# Altium schematic sheet Altium_SCH_ThinkClamp_v0.6.1_tpreset.SchDoc: ThinkClamp v0.6.1
size A4; Date: 18/04/2014
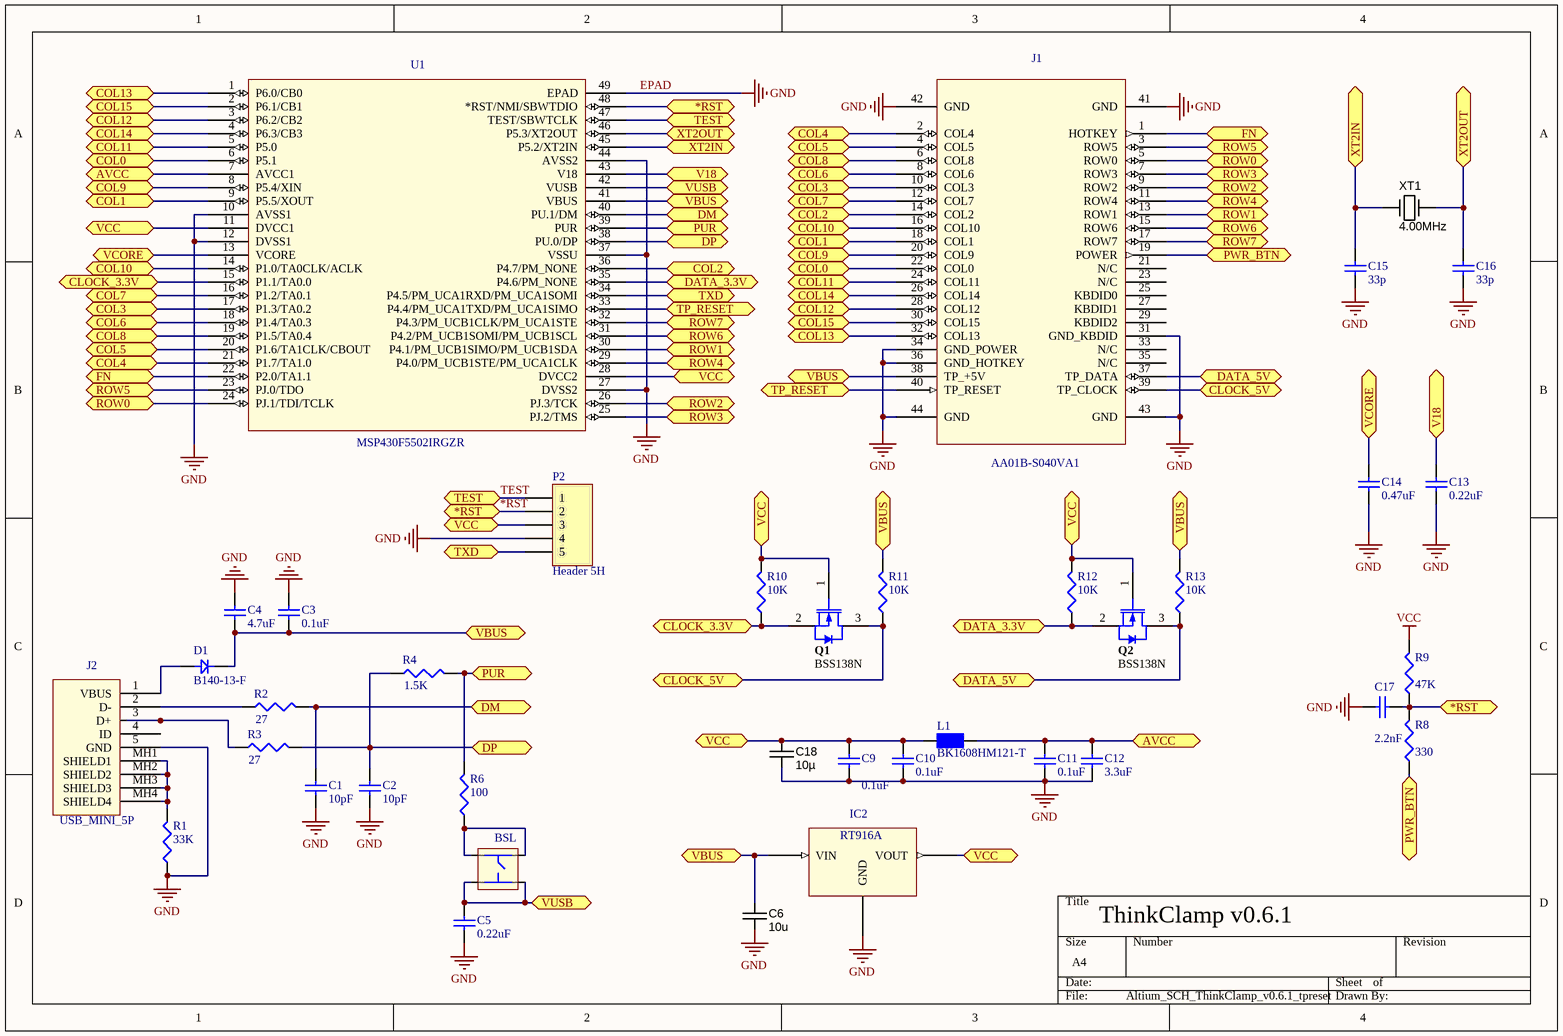
[diagram p0: Altium_SCH_ThinkClamp_v0.6.1_tpreset.SchDoc]

## Parts
BSL  TL3301  [TL3301]  (value not drawn)
C1  value 10pF  [1608[0603]]  (hidden comment: Cap Semi)
C2  value 10pF  [1608[0603]]  (hidden comment: Cap Semi)
C3  value 0.1uF  [1608[0603]]  (hidden comment: Cap Semi)
C4  value 4.7uF  [1608[0603]]  (hidden comment: Cap Semi)
C5  value 0.22uF  [1608[0603]]  (hidden comment: Cap Semi)
C6  value 10u  [CAPC3216X180N]  (hidden comment: approved sub OK)
C9  value 0.1uF  [1608[0603]]  (hidden comment: Cap Semi)
C10  value 0.1uF  [1608[0603]]  (hidden comment: Cap Semi)
C11  value 0.1uF  [1608[0603]]  (hidden comment: Cap Semi)
C12  value 3.3uF  [1608[0603]]  (hidden comment: Cap Semi)
C13  value 0.22uF  [1608[0603]]  (hidden comment: Cap Semi)
C14  value 0.47uF  [1608[0603]]  (hidden comment: Cap Semi)
C15  value 33p  [1608[0603]]  (hidden comment: Cap Semi)
C16  value 33p  [1608[0603]]  (hidden comment: Cap Semi)
C17  value 2.2nF  [1608[0603]]  (hidden comment: Cap Semi)
C18  value 10µ  [CAPC3216X180N]  (hidden comment: approved sub OK)
D1  B140-13-F  [SMA]
IC2  RT9164A LDO  [SOT223]  (value not drawn)
J1  AA01B-S040VA1  [AA01B-S040VA1]
J2  USB_MINI_5P  [USB_Mini-B_Molex_SMT]
L1  BK1608HM121-T  [BK1608HM121-T]
P2  Header 5H  [HDR1X5H]
Q1  BSS138N  [INF-PG-SOT23_N]
Q2  BSS138N  [INF-PG-SOT23_N]
R1  value 33K  [J1-0603]  (hidden comment: Res3)
R2  value 27  [J1-0603]  (hidden comment: Res3)
R3  value 27  [J1-0603]  (hidden comment: Res3)
R4  value 1.5K  [J1-0603]  (hidden comment: Res3)
R6  value 100  [J1-0603]  (hidden comment: Res3)
R8  value 330  [J1-0603]  (hidden comment: Res3)
R9  value 47K  [J1-0603]  (hidden comment: Res3)
R10  value 10K  [J1-0603]  (hidden comment: Res3)
R11  value 10K  [J1-0603]  (hidden comment: Res3)
R12  value 10K  [J1-0603]  (hidden comment: Res3)
R13  value 10K  [J1-0603]  (hidden comment: Res3)
U1  MSP430F5502IRGZR  [RGZ48_5P15X5P15]
XT1  4.00MHz  [CRYSTAL_HC49-US-SM]

## Ports
*RST, AVCC, CLOCK_3.3V, CLOCK_5V, COL0, COL1, COL2, COL3, COL4, COL5, COL6, COL7, COL8, COL9, COL10, COL11, COL12, COL13, COL14, COL15, DATA_3.3V, DATA_5V, DM, DP, FN, PUR, PWR_BTN, ROW0, ROW1, ROW2, ROW3, ROW4, ROW5, ROW6, ROW7, TEST, TP_RESET, TXD, V18, VBUS, VCC, VCORE, VUSB, XT2IN, XT2OUT

## Nets
EPAD: C1.1 C2.1 C3.2 C4.2 C5.1 C6.2 C9.1 C10.1 C11.1 C12.1 C13.2 C14.2 C15.1 C16.1 C17.2 C18.2 IC2.1(GND) J1.31(GND_KBDID) J1.34(GND_POWER) J1.36(GND_HOTKEY) J1.41(GND) J1.42(GND) J1.43(GND) J1.44(GND) J2.5(GND) P2.4 R1.1 U1.10(AVSS1) U1.12(DVSS1) U1.27(DVSS2) U1.37(VSSU) U1.44(AVSS2) U1.49(EPAD)  [also labelled GND]
VCC: R9.2
*RST: C17.1 P2.2 R8.2 R9.1 U1.48(*RST/NMI/SBWTDIO) ; port *RST
AVCC: C11.2 C12.2 L1.2 U1.7(AVCC1) ; port AVCC
CLOCK_3.3V: Q1.2(SOURCE) R10.1 U1.15(P1.1/TA0.0) ; port CLOCK_3.3V
CLOCK_5V: J1.39(TP_CLOCK) Q1.3(DRAIN) R11.1 ; port CLOCK_5V
COL0: J1.22(COL0) U1.6(P5.1) ; port COL0
COL1: J1.18(COL1) U1.9(P5.5/XOUT) ; port COL1
COL2: J1.14(COL2) U1.36(P4.7/PM_NONE) ; port COL2
COL3: J1.10(COL3) U1.17(P1.3/TA0.2) ; port COL3
COL4: J1.2(COL4) U1.21(P1.7/TA1.0) ; port COL4
COL5: J1.4(COL5) U1.20(P1.6/TA1CLK/CBOUT) ; port COL5
COL6: J1.8(COL6) U1.18(P1.4/TA0.3) ; port COL6
COL7: J1.12(COL7) U1.16(P1.2/TA0.1) ; port COL7
COL8: J1.6(COL8) U1.19(P1.5/TA0.4) ; port COL8
COL9: J1.20(COL9) U1.8(P5.4/XIN) ; port COL9
COL10: J1.16(COL10) U1.14(P1.0/TA0CLK/ACLK) ; port COL10
COL11: J1.24(COL11) U1.5(P5.0) ; port COL11
COL12: J1.28(COL12) U1.3(P6.2/CB2) ; port COL12
COL13: J1.32(COL13) U1.1(P6.0/CB0) ; port COL13
COL14: J1.26(COL14) U1.4(P6.3/CB3) ; port COL14
COL15: J1.30(COL15) U1.2(P6.1/CB1) ; port COL15
DATA_3.3V: Q2.2(SOURCE) R12.1 U1.35(P4.6/PM_NONE) ; port DATA_3.3V
DATA_5V: J1.37(TP_DATA) Q2.3(DRAIN) R13.1 ; port DATA_5V
DM: C1.2 R2.2 U1.40(PU.1/DM) ; port DM
DP: C2.2 R3.2 R4.1 U1.38(PU.0/DP) ; port DP
FN: J1.1(HOTKEY) U1.22(P2.0/TA1.1) ; port FN
PUR: R4.2 R6.2 U1.39(PUR) ; port PUR
PWR_BTN: J1.19(POWER) R8.1 ; port PWR_BTN
ROW0: J1.5(ROW0) U1.24(PJ.1/TDI/TCLK) ; port ROW0
ROW1: J1.13(ROW1) U1.30(P4.1/PM_UCB1SIMO/PM_UCB1SDA) ; port ROW1
ROW2: J1.9(ROW2) U1.26(PJ.3/TCK) ; port ROW2
ROW3: J1.7(ROW3) U1.25(PJ.2/TMS) ; port ROW3
ROW4: J1.11(ROW4) U1.29(P4.0/PM_UCB1STE/PM_UCA1CLK) ; port ROW4
ROW5: J1.3(ROW5) U1.23(PJ.0/TDO) ; port ROW5
ROW6: J1.15(ROW6) U1.31(P4.2/PM_UCB1SOMI/PM_UCB1SCL) ; port ROW6
ROW7: J1.17(ROW7) U1.32(P4.3/PM_UCB1CLK/PM_UCA1STE) ; port ROW7
TEST: P2.1 U1.47(TEST/SBWTCLK) ; port TEST
TP_RESET: J1.40(TP_RESET) U1.33(P4.4/PM_UCA1TXD/PM_UCA1SIMO) ; port TP_RESET
TXD: P2.5 U1.34(P4.5/PM_UCA1RXD/PM_UCA1SOMI) ; port TXD
V18: C13.1 U1.43(V18) ; port V18
VBUS: C3.1 C4.1 C6.1 D1.2 IC2.3(VIN) J1.38(TP_+5V) R11.2 R13.2 U1.41(VBUS) ; port VBUS
VCC: C9.2 C10.2 C18.1 IC2.2(VOUT) L1.1 P2.3 Q1.1(GATE) Q2.1(GATE) R10.2 R12.2 U1.11(DVCC1) U1.28(DVCC2) ; port VCC  [a separate net that carries the same name]
VCORE: C14.1 U1.13(VCORE) ; port VCORE
VUSB: BSL.3 BSL.4 C5.2 U1.42(VUSB) ; port VUSB
XT2IN: C15.2 U1.45(P5.2/XT2IN) XT1.1(IN) ; port XT2IN
XT2OUT: C16.2 U1.46(P5.3/XT2OUT) XT1.2(OUT) ; port XT2OUT
NetBSL_1: BSL.1 BSL.2 R6.1
NetD1_1: D1.1 J2.1(VBUS)
NetJ2_2: J2.2(D-) R2.1
NetJ2_3: J2.3(D+) R3.1
NetJ2_MH1: J2.MH1(SHIELD1) J2.MH2(SHIELD2) J2.MH3(SHIELD3) J2.MH4(SHIELD4) R1.2

Not connected (* = marked no-connect by the designer): J1 21(N/C) 23(N/C) 25(KBDID0) 27(KBDID1) 29(KBDID2) 33(N/C) 35(N/C); J2 4(ID)

## Notes on the sheet
- (in symbol RT9164A LDO) RT916A

## Library data of the parts
BSL = TL3301: TL3301, tactile switch, gull wing termination
C1-C5 C9-C17 = Cap Semi: Capacitor (Semiconductor SIM Model); Published: 8-Jun-2000; LatestRevisionDate: 29-May-2009; LatestRevisionNote: IPC-7351 Footprint Added.; PackageReference: J1-0603; Publisher: Altium Limited; PackageDescription: Chip Capacitor
C6 = CAPC_10u_1206_16V: Capacitor SMD Cer 10uF 10% 16V X7R 1206; Manufacturer 1: Kemet; Manufacturer Part Number 1: C1206C106K4RACTU; Ratings: 16V; X7R; Material: ceramic; SCDType: spec; Package / Case: 1206 (3216 metric); Tolerance: ±10%; Supplier 1: Digi-Key; Supplier Part Number 1: 399-3525-1-ND
C18 = CAPC_10u_1206_10V: Capacitor SMD Cer 10uF 10% 10V X5R 1206; Manufacturer 1: KEMET; Manufacturer Part Number 1: C1206C106K8PACTU; Ratings: 10V; X5R; Material: ceramic; SCDType: undef; Package / Case: 1206 (3216 metric); Tolerance: ±10%; Supplier 1: Digi-Key; Supplier Part Number 1: C1206C106K8PACTU-ND
D1 = B140-13-F: B140-13-F, Schottky Diode; Configuration: Single; Maximum continuous forward current: 1A; Peak Forward Voltage: 0.5V; Peak Non-Repetitive Forward Surge Current: 0.03kA; Peak Reverse Current: 10mA; Peak Reverse Repetitive Voltage: 40V; Dimension: 4.6 x 2.92 x 2.1mm; Type: Schottky; Height: 2.1mm; Length: 4.6mm; Package Type: SMA; Pin Count: 2; Width: 2.92mm
IC2 = RT9164A LDO: RT9164-33[P/G]G, 3.3V, LDO
J1 = AA01B-S040VA1: AA01B-S040VA1, LAPTOP KEYBOARD RECEPTACLE
J2 = USB_MINI_5P: Mini USB Connector
L1 = BK1608HM121-T: BK1608HM121, Multilayer Chip Bead Inductor; Impedance: 120; Impedance Measuring Freq: 100MHz; Rated current: 350mA; DC resistance (max): 0.2
P2 = Header 5H: Header, 5-Pin, Right Angle; LatestRevisionDate: 17-Jul-2002; LatestRevisionNote: Re-released for DXP Platform.; Publisher: Altium Limited
Q1 Q2 = BSS138N: N-Channel SIPMOS Small-Signal-Transistor, 60 V VDS, 0.23 A ID, -55 to 150 degC, PG-SOT23, Reel, Green; Manufacturer: Infineon; Green: TRUE; ID (max): 0.23 A; IDpuls (max): 0.92 A; Ptot (max): 0.36 W; QG: 1 nC; RDS (on) (max): 3,500 mOhm; RDS (on) (max) (@4.5V): 6,000 mOhm; RthJA (max): 350 K/W; VDS (max): 60 V; VGS(th) (max): 1.4 V; VGS(th) (min): 0.6 V; DatasheetVersion: Rev. 2.86; PackageVersion: Apr-08; PackageReference: PG-SOT23; PackageDescription: 3-Pin Small Outline Transistor Package, 2.9 x 1.3 mm Body, 0.95 mm Pitch; Supplier 1: Farnell; Supplier Part Number 1: 1156434; Supplier 2: Farnell; Supplier Part Number 2: 1156434RL; Supplier 3: Newark; Supplier Part Number 3: 25M7814; Halogen-free: TRUE; Packing: Reel; Mounting Technology: Surface Mount; PartNumber: BSS138N; ComponentLink1Description: Manufacturer URL; ComponentLink1URL: http://www.infineon.com/; ComponentLink2Description: Datasheet; ComponentLink2URL: http://www.infineon.com/dgdl/BSS138N_Rev2.86_.pdf?folderId=db3a3043156fd573011622e10b5c1f67&fileId=db3a304330f68606013104d944d53efb; ComponentLink3Description: Package Specification; ComponentLink3URL: http://www.infineon.com/dgdl/SOT23-Package_Overview.pdf?folderId=db3a30431936bc4b0119532290053c66&fileId=db3a30431936bc4b0119533468123c85
R1-R4 R6 R8-R13 = Res3: Resistor; Published: 8-Jun-2000; LatestRevisionDate: 29-May-2009; LatestRevisionNote: IPC-7351 Footprint Added.; PackageReference: J1-0603; Publisher: Altium Limited; PackageDescription: Chip Resistor
U1 = MSP430F5502_RGZ_: MSP430F5502, QFN, 48-pin; Manufacturer_Part_Number: msp430f5502_rgz_48; Vendor: Texas Instruments; PACKAGE_DESIGNATOR: RGZ; PIN_COUNT: 48; FAMILY_NAME: 5 Series; INDUSTRY_STD_PKG_TYPE: VQFN; GENERIC_PART_NUMBER: MSP430F5502; Datasheet URL: http://www.ti.com/lit/gpn/MSP430F5502; Manufacturer: Texas Instruments; RefDes: RefDes; Type: DEV; Value: Value
XT1 = Crystal_6MHz_HC49/US: Resonator Ceramic 4.00 MHz 30ppm; Manufacturer 1: CTS-Frequency Controls; Manufacturer Part Number 1: ATS060BSM-1; Ratings: 6.00 MHz; Frequency: 6MHz; Frequency Stability: ±50ppm; Load Capacitance: 18pF; Operating Mode: Fundamental; Parameter Name: 0.169" (4.30mm); SCDType: spec; Package / Case: HC49/US-SM; Supplier 1: Digi-Key; Supplier Part Number 1: CTX882CT-ND; Type: MHz Crystal; Frequency Tolerance: ±30ppm; Operating Temperature: -20°C ~ 70°C; Mounting Type: Surface Mount; Size / Dimension: 0.437" L x 0.190" W (11.10mm x 4.83mm); ComponentLink1URL: http://www.ctscorp.com/components/Datasheets/008-0309-0.pdf; ComponentLink1Description: http://www.ctscorp.com/components/Datasheets/008-0309-0.pdf